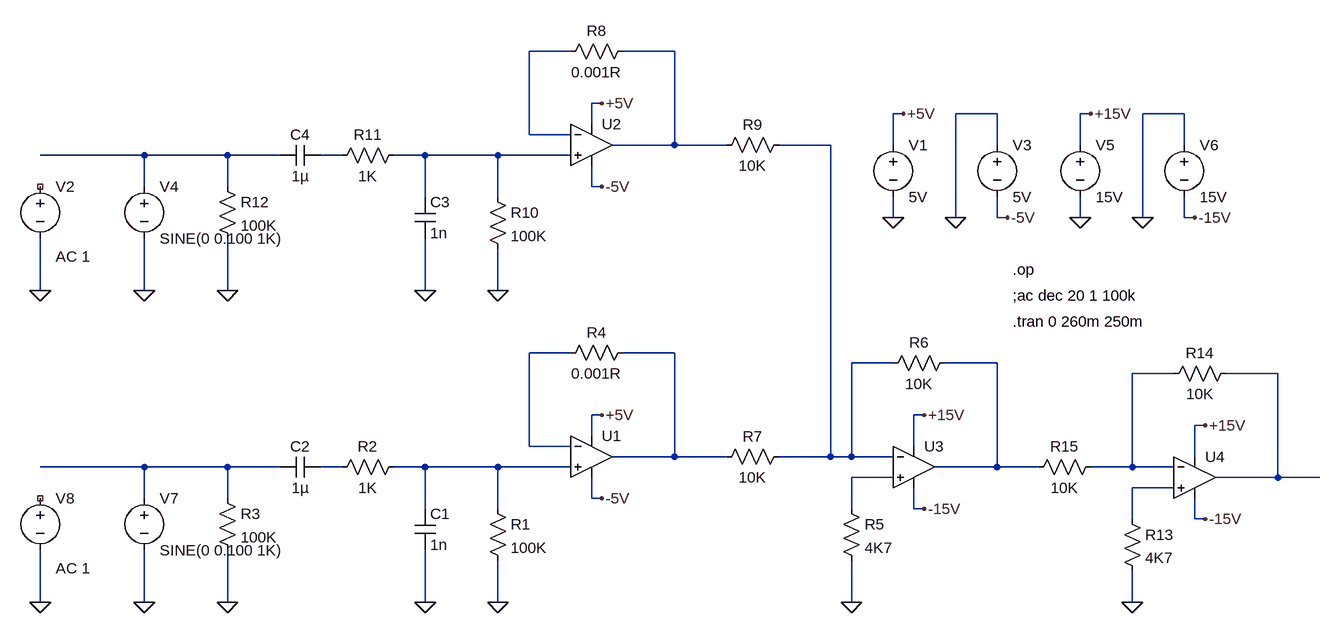
[diagram p0: schematic mixer.asc]
mixer.asc, the LTspice schematic file:
Version 4
SHEET 1 2344 2032
WIRE -3520 496 -3584 496
WIRE -3360 496 -3440 496
WIRE -3472 576 -3488 576
WIRE -3008 592 -3024 592
WIRE -2864 592 -2928 592
WIRE -2720 592 -2736 592
WIRE -2576 592 -2640 592
WIRE -3488 608 -3488 576
WIRE -3584 624 -3584 496
WIRE -3520 624 -3584 624
WIRE -3360 640 -3360 496
WIRE -3360 640 -3456 640
WIRE -3280 640 -3360 640
WIRE -3120 640 -3200 640
WIRE -3024 640 -3024 592
WIRE -2864 640 -2864 592
WIRE -2736 640 -2736 592
WIRE -2576 640 -2576 592
WIRE -4176 656 -4336 656
WIRE -4048 656 -4176 656
WIRE -3968 656 -4048 656
WIRE -3872 656 -3904 656
WIRE -3744 656 -3792 656
WIRE -3632 656 -3744 656
WIRE -3520 656 -3632 656
WIRE -4176 704 -4176 656
WIRE -4048 704 -4048 656
WIRE -3488 704 -3488 672
WIRE -3472 704 -3488 704
WIRE -3744 720 -3744 656
WIRE -3632 720 -3632 656
WIRE -3024 752 -3024 720
WIRE -2928 752 -2928 592
WIRE -2864 752 -2864 720
WIRE -2848 752 -2864 752
WIRE -2736 752 -2736 720
WIRE -2640 752 -2640 592
WIRE -2576 752 -2576 720
WIRE -2560 752 -2576 752
WIRE -4336 864 -4336 784
WIRE -4176 864 -4176 784
WIRE -4048 864 -4048 784
WIRE -3744 864 -3744 784
WIRE -3632 864 -3632 800
WIRE -3520 960 -3584 960
WIRE -3360 960 -3440 960
WIRE -3024 976 -3088 976
WIRE -2864 976 -2944 976
WIRE -2592 992 -2656 992
WIRE -2432 992 -2512 992
WIRE -3472 1056 -3488 1056
WIRE -2976 1056 -2992 1056
WIRE -2544 1072 -2560 1072
WIRE -3488 1088 -3488 1056
WIRE -3584 1104 -3584 960
WIRE -3520 1104 -3584 1104
WIRE -2992 1104 -2992 1056
WIRE -3360 1120 -3360 960
WIRE -3360 1120 -3456 1120
WIRE -3280 1120 -3360 1120
WIRE -3120 1120 -3120 640
WIRE -3120 1120 -3200 1120
WIRE -3088 1120 -3088 976
WIRE -3088 1120 -3120 1120
WIRE -3024 1120 -3088 1120
WIRE -2560 1120 -2560 1072
WIRE -4176 1136 -4336 1136
WIRE -4048 1136 -4176 1136
WIRE -3968 1136 -4048 1136
WIRE -3872 1136 -3904 1136
WIRE -3744 1136 -3792 1136
WIRE -3632 1136 -3744 1136
WIRE -3520 1136 -3632 1136
WIRE -2864 1136 -2864 976
WIRE -2864 1136 -2960 1136
WIRE -2800 1136 -2864 1136
WIRE -2656 1136 -2656 992
WIRE -2656 1136 -2720 1136
WIRE -2592 1136 -2656 1136
WIRE -3024 1152 -3088 1152
WIRE -2432 1152 -2432 992
WIRE -2432 1152 -2528 1152
WIRE -2368 1152 -2432 1152
WIRE -2592 1168 -2656 1168
WIRE -4176 1184 -4176 1136
WIRE -4048 1184 -4048 1136
WIRE -3488 1184 -3488 1152
WIRE -3472 1184 -3488 1184
WIRE -3744 1200 -3744 1136
WIRE -3632 1200 -3632 1136
WIRE -3088 1200 -3088 1152
WIRE -2992 1200 -2992 1168
WIRE -2976 1200 -2992 1200
WIRE -2656 1216 -2656 1168
WIRE -2560 1216 -2560 1184
WIRE -2544 1216 -2560 1216
WIRE -4336 1344 -4336 1264
WIRE -4176 1344 -4176 1264
WIRE -4048 1344 -4048 1264
WIRE -3744 1344 -3744 1264
WIRE -3632 1344 -3632 1280
WIRE -3088 1344 -3088 1280
WIRE -2656 1344 -2656 1296
FLAG -3024 752 0
FLAG -4176 864 0
FLAG -3632 864 0
FLAG -3744 864 0
FLAG -4048 864 0
FLAG -4336 864 0
FLAG -2928 752 0
FLAG -2736 752 0
FLAG -2640 752 0
FLAG -3008 592 +5V
FLAG -2848 752 -5V
FLAG -2720 592 +15V
FLAG -2560 752 -15V
FLAG -3472 576 +5V
FLAG -3472 704 -5V
FLAG -4176 1344 0
FLAG -3632 1344 0
FLAG -3744 1344 0
FLAG -4048 1344 0
FLAG -4336 1344 0
FLAG -3472 1056 +5V
FLAG -3472 1184 -5V
FLAG -3088 1344 0
FLAG -2976 1056 +15V
FLAG -2976 1200 -15V
FLAG -2656 1344 0
FLAG -2544 1072 +15V
FLAG -2544 1216 -15V
SYMBOL VOLTAGE -3024 624 R0
WINDOW 123 0 0 Left 2
WINDOW 39 0 0 Left 2
SYMATTR InstName V1
SYMATTR Value 5V
SYMBOL voltage -4176 688 R0
WINDOW 123 0 0 Left 2
WINDOW 39 0 0 Left 2
SYMATTR InstName V4
SYMATTR Value SINE(0 0.100 1K)
SYMBOL res -3648 704 R0
SYMATTR InstName R10
SYMATTR Value 100K
SYMBOL res -3776 640 R90
WINDOW 0 0 56 VBottom 2
WINDOW 3 32 56 VTop 2
SYMATTR InstName R11
SYMATTR Value 1K
SYMBOL cap -3760 720 R0
SYMATTR InstName C3
SYMATTR Value 1n
SYMBOL cap -3904 640 R90
WINDOW 0 0 32 VBottom 2
WINDOW 3 32 32 VTop 2
SYMATTR InstName C4
SYMATTR Value 1µ
SYMBOL res -4064 688 R0
SYMATTR InstName R12
SYMATTR Value 100K
SYMBOL Opamps\\UniversalOpamp2 -3488 640 R0
SYMATTR InstName U2
SYMBOL res -3424 480 R90
WINDOW 0 0 56 VBottom 2
WINDOW 3 32 56 VTop 2
SYMATTR InstName R8
SYMATTR Value 0.001R
SYMBOL voltage -4336 688 R0
WINDOW 123 24 124 Left 2
WINDOW 39 0 0 Left 2
SYMATTR Value2 AC 1
SYMATTR InstName V2
SYMATTR Value ""
SYMBOL VOLTAGE -2864 624 R0
WINDOW 123 0 0 Left 2
WINDOW 39 0 0 Left 2
SYMATTR InstName V3
SYMATTR Value 5V
SYMBOL VOLTAGE -2736 624 R0
WINDOW 123 0 0 Left 2
WINDOW 39 0 0 Left 2
SYMATTR InstName V5
SYMATTR Value 15V
SYMBOL VOLTAGE -2576 624 R0
WINDOW 123 0 0 Left 2
WINDOW 39 0 0 Left 2
SYMATTR InstName V6
SYMATTR Value 15V
SYMBOL voltage -4176 1168 R0
WINDOW 123 0 0 Left 2
WINDOW 39 0 0 Left 2
SYMATTR InstName V7
SYMATTR Value SINE(0 0.100 1K)
SYMBOL res -3648 1184 R0
SYMATTR InstName R1
SYMATTR Value 100K
SYMBOL res -3776 1120 R90
WINDOW 0 0 56 VBottom 2
WINDOW 3 32 56 VTop 2
SYMATTR InstName R2
SYMATTR Value 1K
SYMBOL cap -3760 1200 R0
SYMATTR InstName C1
SYMATTR Value 1n
SYMBOL cap -3904 1120 R90
WINDOW 0 0 32 VBottom 2
WINDOW 3 32 32 VTop 2
SYMATTR InstName C2
SYMATTR Value 1µ
SYMBOL res -4064 1168 R0
SYMATTR InstName R3
SYMATTR Value 100K
SYMBOL Opamps\\UniversalOpamp2 -3488 1120 R0
SYMATTR InstName U1
SYMBOL res -3424 944 R90
WINDOW 0 0 56 VBottom 2
WINDOW 3 32 56 VTop 2
SYMATTR InstName R4
SYMATTR Value 0.001R
SYMBOL voltage -4336 1168 R0
WINDOW 123 24 124 Left 2
WINDOW 39 0 0 Left 2
SYMATTR Value2 AC 1
SYMATTR InstName V8
SYMATTR Value ""
SYMBOL Opamps\\UniversalOpamp2 -2992 1136 R0
SYMATTR InstName U3
SYMBOL res -3104 1184 R0
SYMATTR InstName R5
SYMATTR Value 4K7
SYMBOL res -2928 960 R90
WINDOW 0 0 56 VBottom 2
WINDOW 3 32 56 VTop 2
SYMATTR InstName R6
SYMATTR Value 10K
SYMBOL res -3184 1104 R90
WINDOW 0 0 56 VBottom 2
WINDOW 3 32 56 VTop 2
SYMATTR InstName R7
SYMATTR Value 10K
SYMBOL res -3184 624 R90
WINDOW 0 0 56 VBottom 2
WINDOW 3 32 56 VTop 2
SYMATTR InstName R9
SYMATTR Value 10K
SYMBOL Opamps\\UniversalOpamp2 -2560 1152 R0
SYMATTR InstName U4
SYMBOL res -2672 1200 R0
SYMATTR InstName R13
SYMATTR Value 4K7
SYMBOL res -2496 976 R90
WINDOW 0 0 56 VBottom 2
WINDOW 3 32 56 VTop 2
SYMATTR InstName R14
SYMATTR Value 10K
SYMBOL res -2704 1120 R90
WINDOW 0 0 56 VBottom 2
WINDOW 3 32 56 VTop 2
SYMATTR InstName R15
SYMATTR Value 10K
TEXT -2840 912 Left 2 !.tran 0 260m 250m
TEXT -2840 872 Left 2 !;ac dec 20 1 100k
TEXT -2840 832 Left 2 !.op

The netlist it stands for:
* mixer.asc
V1 +5V 0 5V
V4 N004 0 SINE(0 0.100 1K)
R10 N006 0 100K
R11 N006 N005 1K
C3 N006 0 1n
C4 N005 N004 1µ
R12 N004 0 100K
XU2 N006 N001 +5V -5V N002 level.2 Avol=1Meg GBW=10Meg Slew=10Meg ilimit=25m rail=0 Vos=0 phimargin=45 en=0 enk=0 in=0 ink=0 Rin=500Meg  ; pins IN+ IN- V+ V- OUT
R8 N002 N001 0.001R
V2 NC_01 0 AC 1
V3 0 -5V 5V
V5 +15V 0 15V
V6 0 -15V 15V
V7 N012 0 SINE(0 0.100 1K)
R1 N014 0 100K
R2 N014 N013 1K
C1 N014 0 1n
C2 N013 N012 1µ
R3 N012 0 100K
XU1 N014 N007 +5V -5V N008 level.2 Avol=1Meg GBW=10Meg Slew=10Meg ilimit=25m rail=0 Vos=0 phimargin=45 en=0 enk=0 in=0 ink=0 Rin=500Meg  ; pins IN+ IN- V+ V- OUT
R4 N008 N007 0.001R
V8 NC_02 0 AC 1
XU3 N015 N003 +15V -15V N009 level.2 Avol=1Meg GBW=10Meg Slew=10Meg ilimit=25m rail=0 Vos=0 phimargin=45 en=0 enk=0 in=0 ink=0 Rin=500Meg  ; pins IN+ IN- V+ V- OUT
R5 N015 0 4K7
R6 N009 N003 10K
R7 N003 N008 10K
R9 N003 N002 10K
XU4 N016 N010 +15V -15V N011 level.2 Avol=1Meg GBW=10Meg Slew=10Meg ilimit=25m rail=0 Vos=0 phimargin=45 en=0 enk=0 in=0 ink=0 Rin=500Meg  ; pins IN+ IN- V+ V- OUT
R13 N016 0 4K7
R14 N011 N010 10K
R15 N010 N009 10K
.tran 0 260m 250m
;ac dec 20 1 100k
.op
.lib UniversalOpamps2.sub
.backanno
.end